# Altium schematic sheet giro.SchDoc
size A4
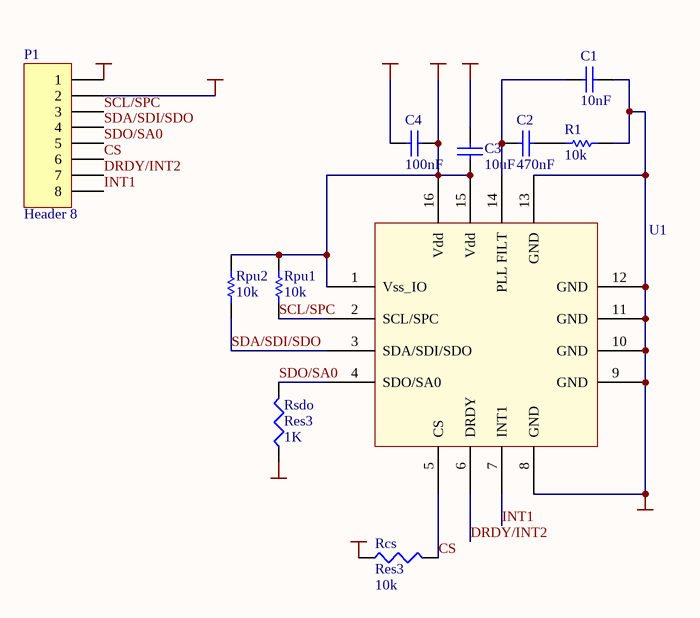
[diagram p0: giro.SchDoc]

## Parts
C1  10nF  [0603]
C2  470nF  [0603]
C3  10uF  [0603]
C4  100nF  [0603]
P1  Header 8  [HDR1X8]
R1  10k  [0603]
Rcs  Res3  value 10k  [C1608-0603]
Rpu1  10k  [0603]
Rpu2  10k  [0603]
Rsdo  Res3  value 1K  [C1608-0603]
U1  L3G4200D  [L3G4200D]  (value not drawn)

## Nets
GND: C1.1 C3.2 C4.2 P1.1 R1.2 Rsdo.1 U1.8(GND) U1.9(GND) U1.10(GND) U1.11(GND) U1.12(GND) U1.13(GND)
VCC: C3.1 C4.1 P1.2 Rcs.1 Rpu1.1 Rpu2.1 U1.1(Vss_IO) U1.15(Vdd) U1.16(Vdd)
CS: P1.6 Rcs.2 U1.5(CS)
DRDY/INT2: P1.7 U1.6(DRDY)
INT1: P1.8 U1.7(INT1)
SCL/SPC: P1.3 Rpu1.2 U1.2(SCL/SPC)
SDA/SDI/SDO: P1.4 Rpu2.2 U1.3(SDA/SDI/SDO)
SDO/SA0: P1.5 Rsdo.2 U1.4(SDO/SA0)
NetC1_2: C1.2 C2.1 U1.14(PLL_FILT)
NetC2_2: C2.2 R1.1

## Library data of the parts
C1-C4 = Cap: Capacitor; Published: 8-Jun-2000; LatestRevisionDate: 17-Jul-2002; LatestRevisionNote: Re-released for DXP Platform.; Publisher: Altium Limited
P1 = Header 8: Header, 8-Pin; LatestRevisionDate: 17-Jul-2002; LatestRevisionNote: Re-released for DXP Platform.; Publisher: Altium Limited
R1 Rpu1 Rpu2 = Res Semi: Semiconductor Resistor; Published: 8-Jun-2000; LatestRevisionDate: 17-Jul-2002; LatestRevisionNote: Re-released for DXP Platform.; Publisher: Altium Limited
Rcs Rsdo = Res3: Resistor; Published: 8-Jun-2000; Revision: July-2002: Re-released for DXP Platform.; Publisher: Altium Limited
U1 = L3G4200D: Giro 3 axis; RS: 721-2483; Fabricante: ST; Módelo: L3G4200D; Distribuidor: RS